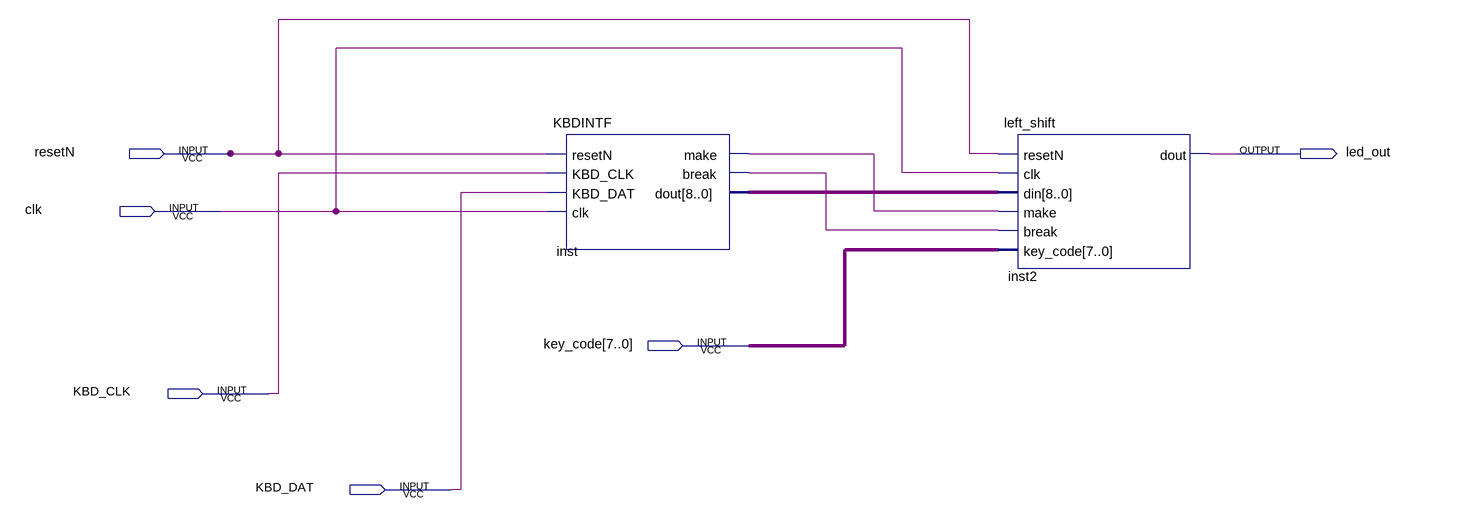
[diagram p0: schematic sheet]
// Quartus schematic Test_Toggle.bdf as structural Verilog: 2 symbols, 6 pins
module Test_Toggle (
  input  resetN,
  input  clk,
  input  [7:0] key_code,
  input  KBD_CLK,
  input  KBD_DAT,
  output led_out
);

  wire inst_break, inst_make;
  wire [8:0] inst_dout;

  KBDINTF inst (
    .resetN(resetN), .KBD_CLK(KBD_CLK), .KBD_DAT(KBD_DAT), .clk(clk), .make(inst_make), .\break (inst_break),
    .dout(inst_dout));
  left_shift inst2 (
    .resetN(resetN), .clk(clk), .din(inst_dout), .make(inst_make), .\break (inst_break), .key_code(key_code),
    .dout(led_out));
endmodule
